# EAGLE design untitled (EAGLE 6.2)
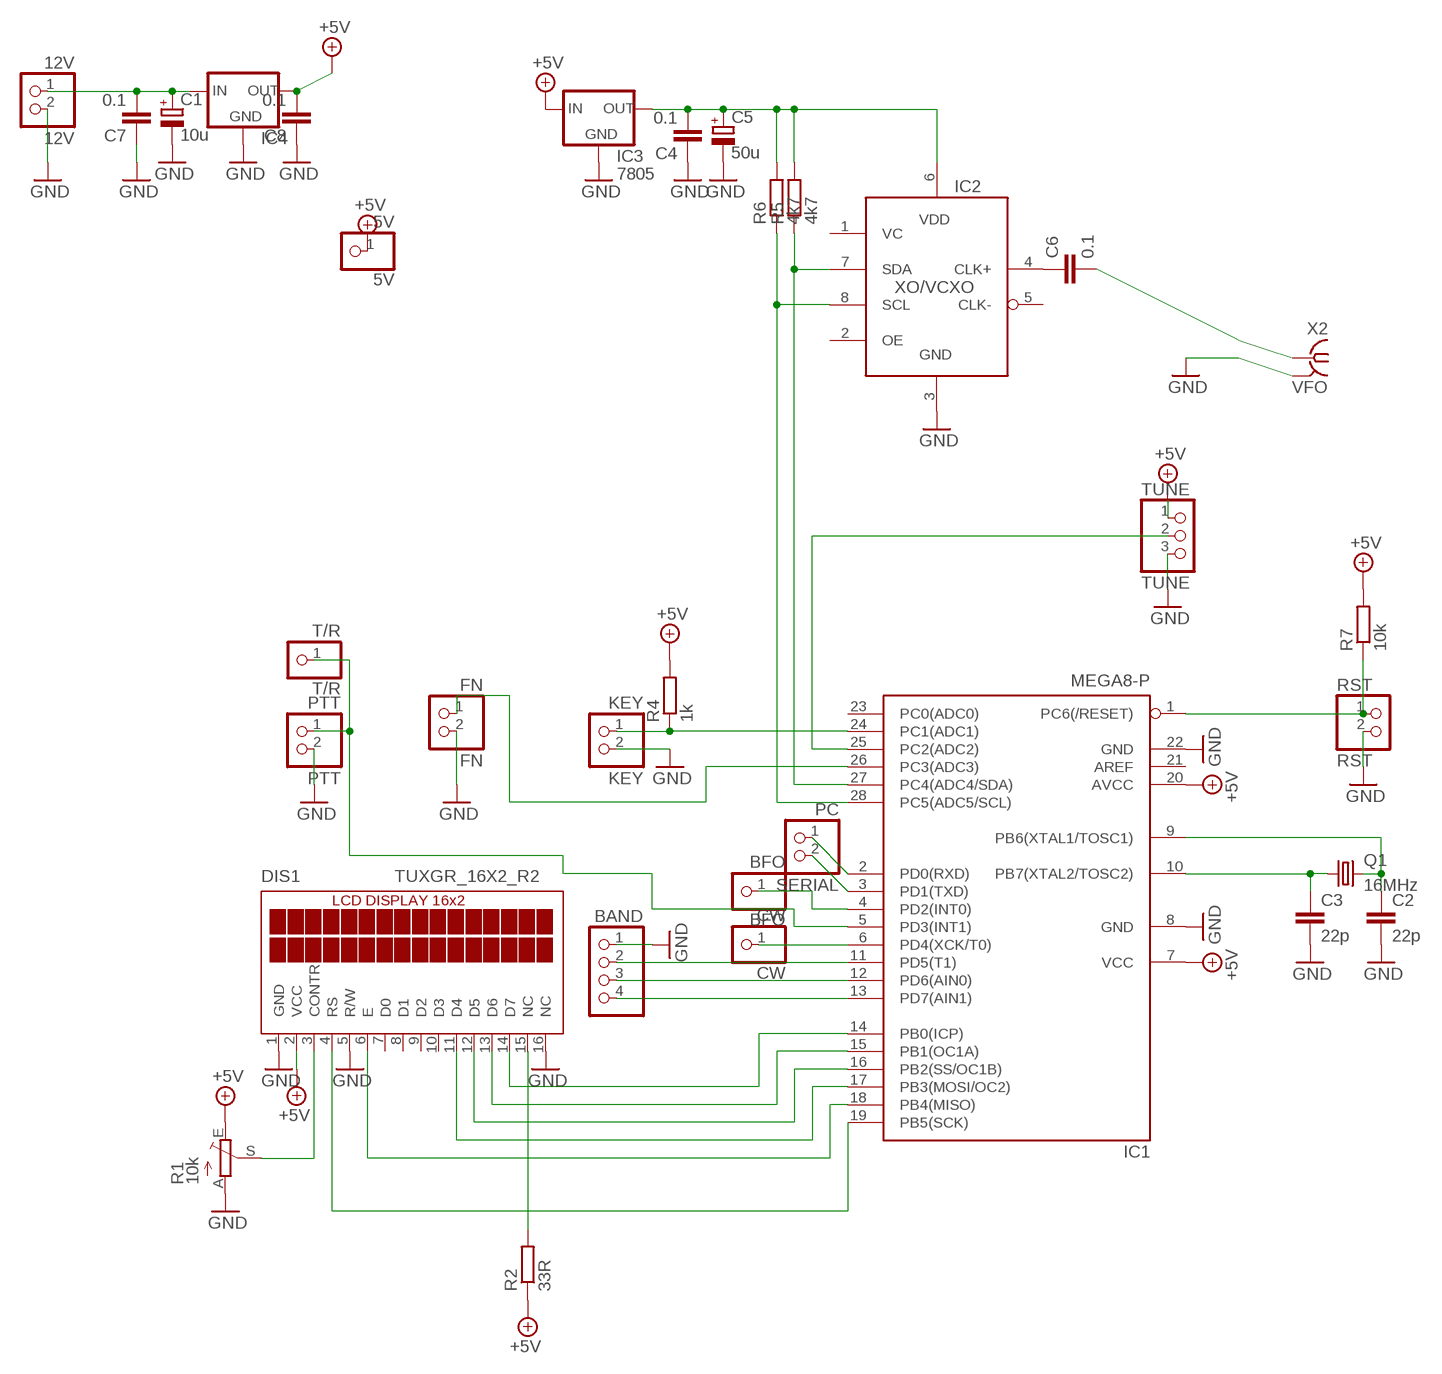
[diagram p0: schematic, sheet 1]

## Parts
5V  5V  PINHD-1X1  [1X01]
12V  12V  PINHD-1X2  [1X02]
BAND  PINHD-1X4  [1X04]
BFO  BFO  PINHD-1X1  [1X01]
C1  10u  CPOL-EUE2.5-5  [E2,5-5]
C2  22p  C-EUC1206  [C1206]
C3  22p  C-EUC1206  [C1206]
C4  0.1  C-EU050-024X044  [C050-024X044]
C5  50u  CPOL-EUE2.5-5  [E2,5-5]
C6  0.1  C-EU050-024X044  [C050-024X044]
C7  0.1  C-EU050-024X044  [C050-024X044]
C8  0.1  C-EU050-024X044  [C050-024X044]
CW  CW  PINHD-1X1  [1X01]
DIS1  TUXGR_16X2_R2  [TUXGR_16X2_R2]
FN  FN  PINHD-1X2  [1X02]
IC1  MEGA8-P  [DIL28-3]
IC2  SI57X  [SI57X]
IC3  7805  LM1117TO252  [TO252]
IC4  78XXL  [78XXL]
KEY  KEY  PINHD-1X2  [1X02]
PC  SERIAL  PINHD-1X2  [1X02]
PTT  PTT  PINHD-1X2  [1X02]
Q1  16MHz  CRYSTALHC49S  [HC49/S]
R1  10k  TRIM_EU-CA6V  [CA6V]
R2  33R  R-EU_0207/15  [0207/15]
R4  1k  R-EU_0204/5  [0204/5]
R5  4k7  R-EU_0204/5  [0204/5]
R6  4k7  R-EU_0204/5  [0204/5]
R7  10k  R-EU_0204/5  [0204/5]
RST  RST  PINHD-1X2  [1X02]
T/R  T/R  PINHD-1X1  [1X01]
TUNE  TUNE  PINHD-1X3  [1X03]
X2  VFO  BU-SMA-H  [BU-SMA-H]

## Nets
+5V: 5V.1 C8.2 DIS1.2(VCC) IC1.7(VCC) IC1.20(AVCC) IC3.2(IN) IC4.OUT R1.E R2.1 R4.2 R7.2 TUNE.1
GND: 12V.2 BAND.1 C1.- C2.2 C3.2 C4.1 C5.- C7.1 C8.1 DIS1.1(GND) DIS1.5(R/W) DIS1.16(NC) FN.2 IC1.8(GND) IC1.22(GND) IC2.3(GND) IC3.1(GND) IC4.GND KEY.2 PTT.2 R1.A RST.2 TUNE.3 X2.2(GND)
N$1: DIS1.4(RS) IC1.19(PB5(SCK))
N$2: DIS1.14(D7) IC1.14(PB0(ICP))
N$3: DIS1.13(D6) IC1.15(PB1(OC1A))
N$4: DIS1.12(D5) IC1.16(PB2(SS/OC1B))
N$5: DIS1.11(D4) IC1.17(PB3(MOSI/OC2))
N$6: DIS1.6(E) IC1.18(PB4(MISO))
N$7: DIS1.3(CONTR) R1.S
N$8: DIS1.15(NC) R2.2
N$9: C2.1 IC1.9(PB6(XTAL1/TOSC1)) Q1.2
N$10: C3.1 IC1.10(PB7(XTAL2/TOSC2)) Q1.1
N$11: IC1.24(PC1(ADC1)) KEY.1 R4.1
N$12: BAND.2 IC1.11(PD5(T1))
N$13: BAND.3 IC1.12(PD6(AIN0))
N$14: BAND.4 IC1.13(PD7(AIN1))
N$15: FN.1 IC1.26(PC3(ADC3))
N$16: CW.1 IC1.6(PD4(XCK/T0))
N$17: IC1.5(PD3(INT1)) PTT.1 T/R.1
N$18: BFO.1 IC1.4(PD2(INT0))
N$19: IC1.27(PC4(ADC4/SDA)) IC2.7(SDA) R5.1
N$20: IC1.28(PC5(ADC5/SCL)) IC2.8(SCL) R6.1
N$21: C4.2 C5.+ IC2.6(VDD) IC3.3(OUT) R5.2 R6.2
N$22: C6.1 IC2.4(CLK+)
N$23: C6.2 X2.1
N$24: IC1.25(PC2(ADC2)) TUNE.2
N$25: IC1.1(PC6(/RESET)) R7.1 RST.1
N$26: 12V.1 C1.+ C7.2 IC4.IN
N$27: IC1.2(PD0(RXD)) PC.1
N$28: IC1.3(PD1(TXD)) PC.2
Unconnected: DIS1.7(D0) DIS1.8(D1) DIS1.9(D2) DIS1.10(D3) IC1.21(AREF) IC1.23(PC0(ADC0)) IC2.1(VC) IC2.2(OE) IC2.5(CLK-)

## Power pins joined to a net without a drawn wire
GND: X2.3(GND) X2.4(GND) X2.5(GND)

## Library data of the parts
5V BFO CW T/R = pinhead:PINHD-1X1: PIN HEADER
12V FN KEY PC PTT RST = pinhead:PINHD-1X2: PIN HEADER
BAND = pinhead:PINHD-1X4: PIN HEADER
C1 C5 = rcl:CPOL-EU: POLARIZED CAPACITOR, European symbol
C2-C4 C6-C8 = rcl:C-EU: CAPACITOR, European symbol
DIS1 = display-lcd:TUXGR_16X2_R2: Tuxgraphics LCD display 16x2 characters reflective, without background light Source: tuxgr_12x2_r2.pdf; OC_FARNELL: unknown; OC_NEWARK: unknown
IC1 = atmel:MEGA8-P: MICROCONTROLLER 8 Kbytes FLASH, 1 kbytes SRAM, 512 bytes EEPROM, USART, 4-channel 10 bit ADC, 2-channel 8 bit ADC Pin compatible with Atmega48, ATMega88, ATMega168 Source: avr.lbr; OC_FARNELL: unknown; OC_NEWARK: unknown
IC2 = si57x:SI57X: Any Rate I2C Prorammable XO/VCXO SiliconLabs Si570 XO and Si571 VCXO
IC3 = v-reg-2:LM1117
IC4 = v-reg:78XXL: VOLTAGE REGULATOR
Q1 = crystal:CRYSTAL: CRYSTAL; OC_FARNELL: 1667008; OC_NEWARK: unknown
R1 = pot:TRIM_EU-: POTENTIOMETER
R2 R4-R7 = rcl:R-EU_: RESISTOR, European symbol
TUNE = pinhead:PINHD-1X3: PIN HEADER
X2 = con-coax:BU-SMA-H: FEMALE SMA CONNECTOR Radiall; OC_FARNELL: unknown; OC_NEWARK: unknown

## Board
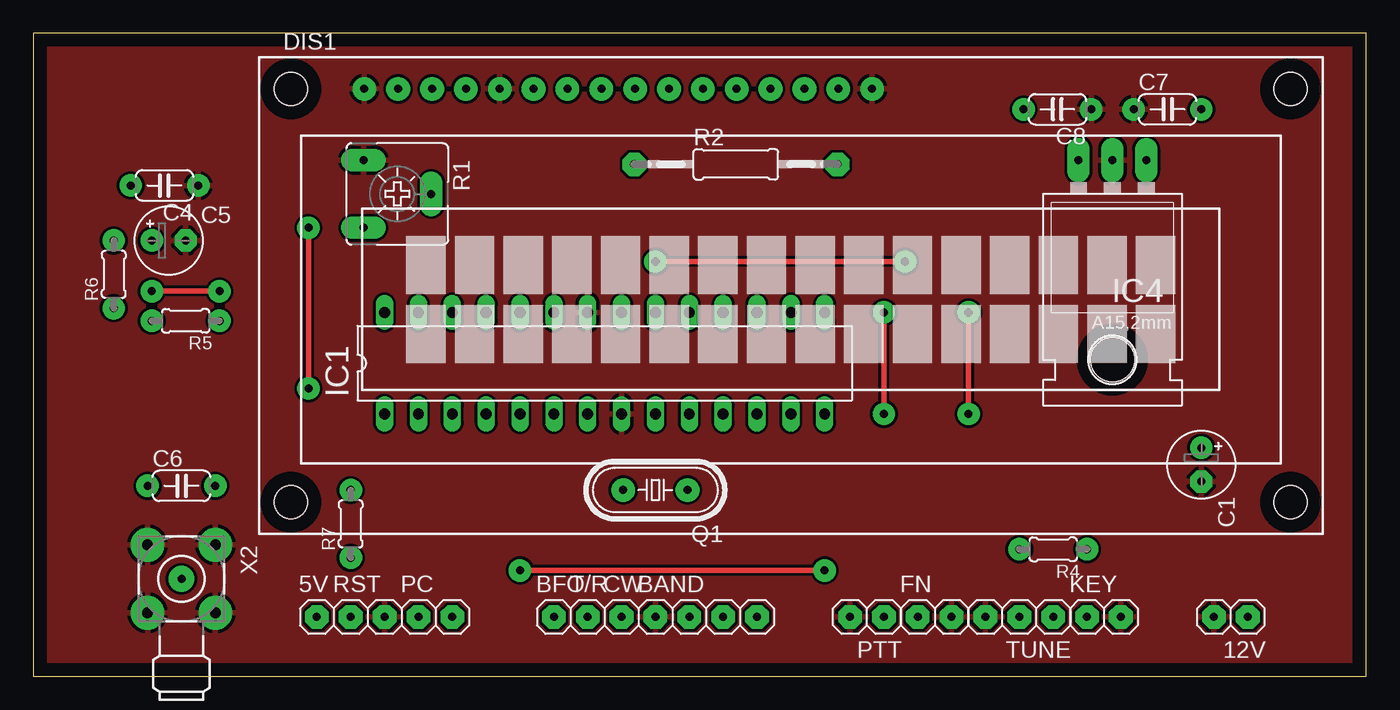
[diagram p1: board, top side]
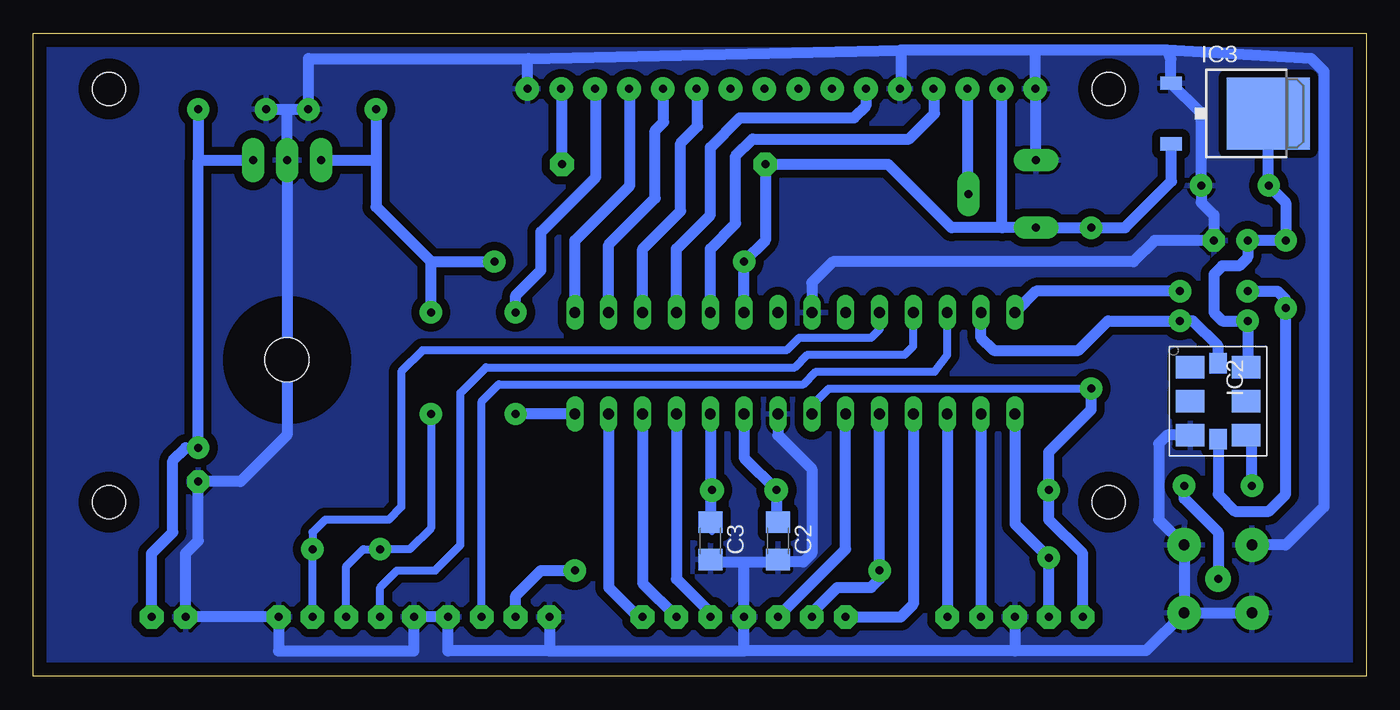
[diagram p2: board, bottom side, seen from below]

Size 100 x 48.25 mm. Coordinates in mm from the lower left corner, seen from the top.
Outline: 0,0 100,0 100,48.25 0,48.25 0,0
Copper layers (1*16): Top 0.035mm / dielectric 1.5mm / Bottom 0.035mm
Design rules "default": minimum track width 10mil, minimum drill 24mil, track to track 8mil, track to pad 8mil, pad to pad 8mil, via to via 8mil, smd to smd 8mil, copper to edge 40mil, drill to drill 8mil, minimum pad ring 10mil, minimum via ring 8mil, stop-mask expansion 4mil, vias tented up to drill 0mil, thermal gap 10mil

### Footprints (pad centres in the part's own frame; a part is rotated, then mirrored left to right if it is on the bottom)
1X01 = drill 0.6 pad 1.778 octagon: 1 0,0
1X02 = drill 0.6 pad 1.778 octagon: 1 -1.27,0; 2 1.27,0
1X04 = drill 0.6 pad 1.778 octagon: 1 -3.81,0; 2 -1.27,0; 3 1.27,0; 4 3.81,0
E2,5-5 = drill 0.6 pad 1.676: + -1.27,0 | drill 0.6 pad 1.676 octagon: - 1.27,0
C1206 = smd 1.6 x 1.8: 1 -1.4,0; 2 1.4,0
C050-024X044 = drill 0.6 pad 1.676: 1 -2.54,0; 2 2.54,0
TUXGR_16X2_R2 = drill 0.6 pad 1.778: 1 -32,15.5; 2 -29.46,15.5; 3 -26.92,15.5; 4 -24.38,15.5; 5 -21.84,15.5; 6 -19.3,15.5; 7 -16.76,15.5; 8 -14.22,15.5; 9 -11.68,15.5; 10 -9.14,15.5; 11 -6.6,15.5; 12 -4.06,15.5; 13 -1.52,15.5; 14 1.02,15.5; 15 3.56,15.5; 16 6.1,15.5 | hole 2.5: -37.5,-15.5; 37.5,-15.5; -37.5,15.5; 37.5,15.5
DIL28-3 = drill 0.813 long: 1 -16.51,-3.81; 2 -13.97,-3.81; 3 -11.43,-3.81; 4 -8.89,-3.81; 5 -6.35,-3.81; 6 -3.81,-3.81; 7 -1.27,-3.81; 8 1.27,-3.81; 9 3.81,-3.81; 10 6.35,-3.81; 11 8.89,-3.81; 12 11.43,-3.81; 13 13.97,-3.81; 14 16.51,-3.81; 15 16.51,3.81; 16 13.97,3.81; 17 11.43,3.81; 18 8.89,3.81; 19 6.35,3.81; 20 3.81,3.81; 21 1.27,3.81; 22 -1.27,3.81; 23 -3.81,3.81; 24 -6.35,3.81; 25 -8.89,3.81; 26 -11.43,3.81; 27 -13.97,3.81; 28 -16.51,3.81
SI57X = smd 1.7 x 2.15: 1 -2.54,-2.1; 2 0,-2.1; 3 2.54,-2.1; 4 2.54,2.1; 5 0,2.1; 6 -2.54,2.1 | smd 1.545 x 1.3: 7 -2.853,0; 8 2.853,0
TO252 = smd 1 x 1.6: 1 -2.28,-6.07; 2 2.28,-6.07 | smd 5.4 x 6.2: 3 0,1.23
78XXL = drill 0.6 pad 1.676 long: GND 0,-3.81; IN -2.54,-3.81; OUT 2.54,-3.81 | hole 3.302: 0,11.176
HC49/S = drill 0.6 pad 1.778: 1 -2.413,0; 2 2.413,0
CA6V = drill 0.6 pad 1.676 long: A -2.54,-2.54; E 2.54,-2.54; S 0,2.54
0207/15 = drill 0.6 pad 1.778 octagon: 1 -7.62,0; 2 7.62,0
0204/5 = drill 0.6 pad 1.676: 1 -2.54,0; 2 2.54,0
1X03 = drill 0.6 pad 1.778 octagon: 1 -2.54,0; 2 0,0; 3 2.54,0
BU-SMA-H = drill 0.6 pad 1.93: 1 0,0 | drill 0.8 pad 2.54: 2 -2.55,2.55; 3 2.55,2.55; 4 2.55,-2.55; 5 -2.55,-2.55

### Placement (x,y rotation side)
5V  21.27,4.45 0 top
12V  89.85,4.45 180 top
BAND  50.48,4.45 0 top
BFO  39.05,4.45 0 top
C1  87.63,15.88 270 top
C2  44.13,10.16 270 bottom
C3  49.21,10.16 270 bottom
C4  9.84,36.83 180 top
C5  10.16,32.7 0 top
C6  11.11,14.29 0 top
C7  85.09,42.55 0 top
C8  76.83,42.55 180 top
CW  44.13,4.45 0 top
DIS1  56.83,28.57 0 top
FN  67.63,4.45 0 top
IC1  42.86,23.5 0 top
IC2  11.11,20.64 270 bottom
IC3  8.57,42.23 270 bottom
IC4  80.96,34.92 180 top
KEY  80.33,4.45 0 top
PC  30.16,4.45 0 top
PTT  62.55,4.45 180 top
Q1  46.67,13.97 180 top
R1  27.3,36.2 270 top
R2  52.7,38.42 0 top
R4  76.52,9.53 180 top
R5  11.43,26.67 180 top
R6  6.03,30.16 90 top
R7  23.81,11.43 90 top
RST  25.08,4.45 0 top
T/R  41.59,4.45 0 top
TUNE  73.98,4.45 180 top
X2  11.11,7.3 270 top

### Tracks (layer width: path | path; a pad name or v marks a point on that pad's centre or on a via)
+5V  (via drill 0.6 pad 1.68)
  Top 0.406: v65.41,31.11 v46.67,31.11 | v70.17,27.3 v70.17,19.68 | v20.64,21.59 v20.64,33.66
  Bottom 0.406: 65.09,30.8 v65.41,31.11
  Bottom 0.61: IC1.7 41.59,20.32 40.32,21.59 v20.64,21.59 | v70.17,19.68 70.17,11.11 71.75,9.53 R4.2 75.25,9.53 76.52,8.26 TUNE.1
  Bottom 0.813: IC1.20 v46.67,31.11 45.09,32.7 R2.1 35.88,38.42 31.11,33.66 27.3,33.66 | 27.3,33.66 R1.E v20.64,33.66 18.1,33.66 14.61,37.15 14.61,39.59 IC3.2 | DIS1.2 27.37,33.72 27.3,33.66 | v70.17,27.3 70.17,31.11 | 70.17,31.11 v65.41,31.11 | C8.2 74.3,38.73 | 74.3,38.73 74.3,35.24 70.17,31.11 | IC4.OUT 74.3,38.73 | v20.64,21.59 20.64,20 23.81,16.83 R7.2 23.81,11.75 21.27,9.21 5V.1
GND
  Bottom 0.813: 46.67,8.57 BAND.1 46.67,1.91 | 46.67,8.57 44.32,8.57 C2.2 43.95,8.57 42.23,8.57 41.59,9.21 41.59,15.56 44.13,18.1 IC1.8 | C3.2 49.21,8.57 46.67,8.57 | RST.2 26.35,1.91 | 26.35,1.91 46.67,1.91 | 61.28,1.91 46.67,1.91 | PTT.2 61.28,1.91 | 61.28,1.91 68.9,1.91 FN.2 TUNE.3 71.44,1.91 81.6,1.91 KEY.2 12V.2 88.58,9.21 87.63,10.16 C1.- 84.45,14.61 80.96,18.1 IC4.GND 80.96,42.55 | X2.3 16.52,1.92 26.34,1.92 26.35,1.91 | R1.A 24.83,38.8 DIS1.1 24.83,46.29 24.77,46.99 | 24.77,46.99 34.92,46.99 | 34.92,46.99 34.92,44.14 DIS1.5 | DIS1.16 62.93,46.29 | 62.93,46.29 62.87,46.35 34.92,46.99 | 62.93,46.29 79.31,46.29 79.38,46.35 C8.1 80.96,42.55 | C7.1 80.96,42.55 | 14.92,46.99 4.13,46.35 3.17,45.4 3.17,12.7 6.03,9.84 8.26,9.84 | 14.92,46.99 24.77,46.99 | 14.92,46.99 14.64,46.32 IC3.1 12.38,42.25 C4.1 12.38,35.56 11.43,34.61 C5.- 15.88,32.7 17.46,31.11 40.01,31.11 41.59,29.53 IC1.22 | X2.3 X2.4 | X2.3 X2.2 15.56,11.75 15.56,17.46 14.92,18.1 IC2.3 | 8.26,9.84 8.57,9.53 8.57,9.84 8.26,9.84
  pour Bottom (isolate 0.61): 100.65,48.26 -0.32,48.58 -0.32,-0.32 100.65,-0.64
  pour Top: -1.27,49.53 101.6,49.53 101.6,-1.27 -1.27,-1.27
N$1
  Bottom 0.813: IC1.19 49.21,32.07 47.31,33.97 47.31,39.05 46.04,40.32 34.29,40.32 32.38,42.23 32.38,44.01 DIS1.4
N$2  (via drill 0.6 pad 1.68)
  Top 0.406: v63.82,19.68 v63.82,27.3
  Bottom 0.813: IC1.14 v63.82,19.68 | v63.82,27.3 63.82,28.57 61.91,30.48 61.91,33.34 57.78,37.47 57.78,44.01 DIS1.14
N$3
  Bottom 0.813: IC1.15 59.37,32.7 55.24,36.83 55.24,44.01 DIS1.13
N$4
  Bottom 0.813: IC1.16 56.83,32.38 53.34,35.88 53.34,40.96 52.7,41.59 52.7,44.01 DIS1.12
N$5
  Bottom 0.813: IC1.17 54.29,32.07 51.44,34.92 51.44,40.01 50.16,41.27 50.16,44.01 DIS1.11
N$6
  Bottom 0.813: IC1.18 51.75,32.07 49.21,34.61 49.21,39.69 46.99,41.91 38.42,41.91 37.53,42.8 DIS1.6
N$7
  Bottom 0.813: DIS1.3 29.91,36.26 R1.S
N$8
  Bottom 0.813: R2.2 60.33,44.01 DIS1.15
N$9
  Bottom 0.813: IC1.9 46.67,16.38 Q1.2 44.26,11.69 C2.1
N$10
  Bottom 0.406: 49.21,13.46 Q1.1 | 49.09,10.8 C3.1
  Bottom 0.813: IC1.10 49.21,14.1 Q1.1 | 49.21,13.46 C3.1
N$11
  Bottom 0.61: KEY.1 R4.1 79.06,10.79 78.11,11.75 73.34,11.75 72.39,12.7 72.39,22.86 70.8,24.45 43.5,24.45 42.55,25.4 37.15,25.4 36.51,26.04 IC1.24
N$12
  Bottom 0.813: IC1.11 51.75,7.3 49.21,4.76 BAND.2
N$13
  Bottom 0.813: IC1.12 54.29,6.99 BAND.3
N$14
  Bottom 0.813: IC1.13 56.83,6.67 54.29,4.13 BAND.4
N$15
  Bottom 0.61: FN.1 66.36,20.64 65.09,21.91 42.23,21.91 41.27,22.86 32.38,22.86 31.43,24.13 IC1.26
N$16
  Bottom 0.813: IC1.6 39.05,9.53 CW.1
N$17  (via drill 0.6 pad 1.68)
  Top 0.406: v59.37,7.94 v36.51,7.94
  Bottom 0.813: IC1.5 v36.51,7.94 36.51,7.3 37.15,6.67 39.69,6.67 41.59,4.76 T/R.1 | PTT.1 63.82,6.03 61.91,7.94 v59.37,7.94
N$18
  Bottom 0.813: IC1.4 33.97,5.4 34.92,4.45 BFO.1
N$19
  Bottom 0.813: IC1.27 28.89,25.4 27.94,24.45 21.59,24.45 19.37,26.67 R5.1 13.02,26.67 11.11,24.77 IC2.7
N$20  (via drill 0.6 pad 1.68)
  Top 0.406: v13.97,28.89 v8.89,28.89
  Bottom 0.813: IC2.8 11.11,13.65 9.84,12.38 7.3,12.38 6.03,13.65 R6.1 6.03,28.26 6.67,28.89 v8.89,28.89 | v13.97,28.89 24.77,28.89 IC1.28
N$21
  Bottom 0.813: IC3.3 7.34,36.79 C4.2 6.03,35.56 R6.2 C5.+ 8.89,31.43 9.53,30.8 10.79,30.8 11.43,30.16 11.43,27.3 10.79,26.67 R5.2 8.89,22.98 IC2.6
N$22
  Bottom 0.813: C6.1 8.57,17.66 IC2.4
N$23
  Bottom 0.813: C6.2 13.65,13.34 11.11,10.79 X2.1
N$24
  Bottom 0.61: IC1.25 33.97,24.77 34.61,24.13 41.91,24.13 42.86,23.18 66.04,23.18 67.94,21.27 67.94,9.84 69.85,7.94 72.71,7.94 73.98,6.67 TUNE.2
N$25
  Bottom 0.813: IC1.1 26.35,11.43 R7.1 RST.1
N$26
  Bottom 0.813: 12V.1 91.12,9.21 89.53,10.79 89.53,16.19 88.58,17.14 C1.+ 87.63,38.73 | 87.63,38.73 IC4.IN | C7.2 87.63,38.73
N$27
  Bottom 0.813: IC1.2 PC.1
N$28
  Bottom 0.813: IC1.3 PC.2